# EAGLE schematic spi_tiny_usb (EAGLE 6.1)
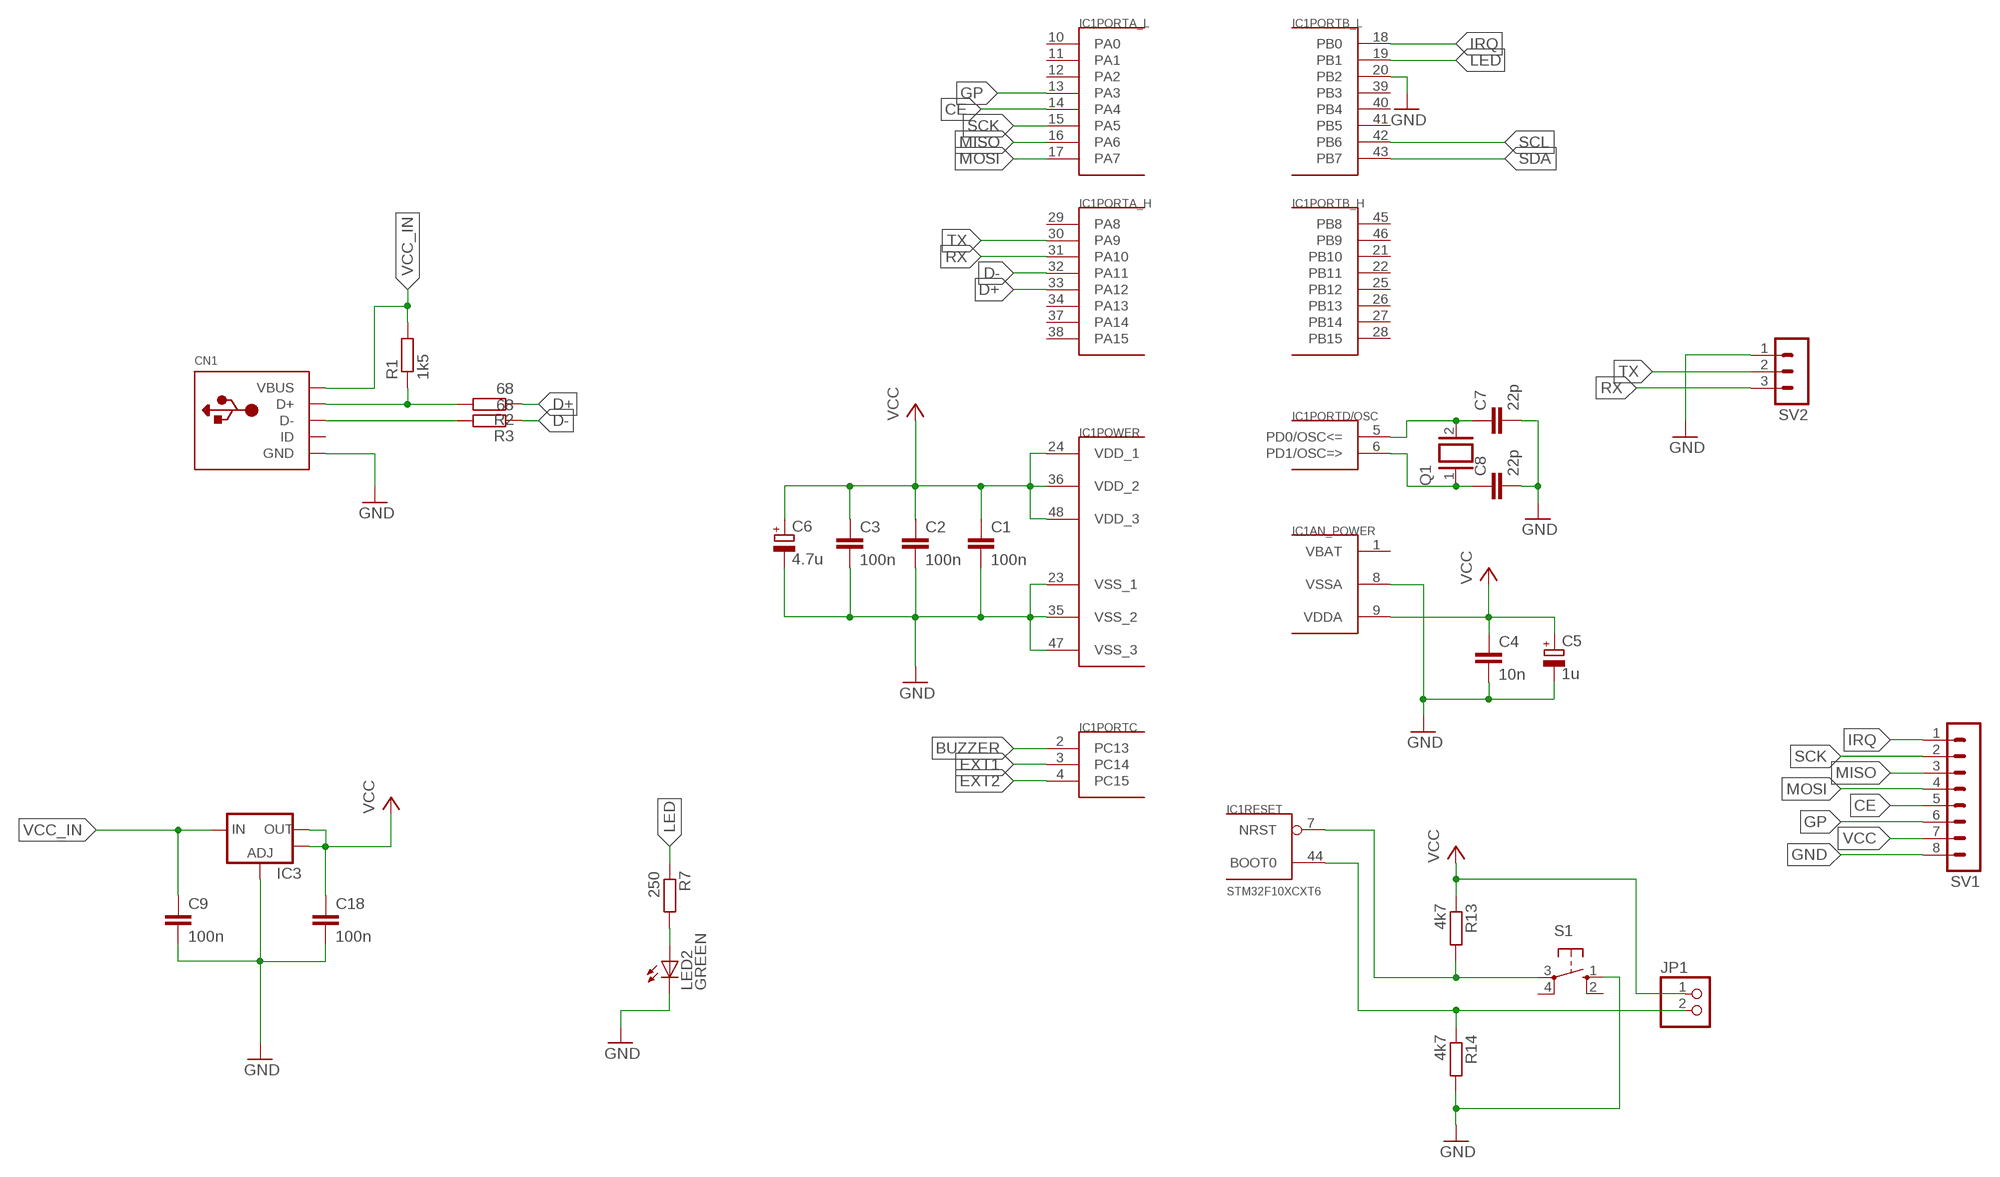
[diagram p0: schematic, sheet 1]

## Parts
C1  100n  C-EUC0805  [C0805]
C2  100n  C-EUC0805  [C0805]
C3  100n  C-EUC0805  [C0805]
C4  10n  C-EUC0805  [C0805]
C5  1u  CPOL-EU153CLV-0505  [153CLV-0505]
C6  4.7u  CPOL-EU153CLV-0505  [153CLV-0505]
C7  22p  C-EUC0805  [C0805]
C8  22p  C-EUC0805  [C0805]
C9  100n  C-EUC0805  [C0805]
C18  100n  C-EUC0805  [C0805]
CN1  USBMINIB  [USB-MINIB]
IC1  STM32F10XCXT6  [TQFP48]
IC3  V_REG_LM1117SOT223  [SOT223]
JP1  PINHD-1X2  [1X02]
LED2  GREEN  LEDCHIPLED_0805  [CHIPLED_0805]
Q1  XTAL/S  [QS]
R1  1k5  R-EU_M1206  [M1206]
R2  68  R-EU_M0805  [M0805]
R3  68  R-EU_M0805  [M0805]
R7  250  R-EU_R0805  [R0805]
R13  4k7  R-EU_R0805  [R0805]
R14  4k7  R-EU_R1206  [R1206]
S1  10-XX  [B3F-10XX]
SV1  MA08-1  [MA08-1]
SV2  MA03-1  [MA03-1]

## Nets
BUZZER: IC1.2(PORTC:PC13)
CE: IC1.14(PORTA_L:PA4) SV1.5
D+: IC1.33(PORTA_H:PA12) R2.1
D-: IC1.32(PORTA_H:PA11) R3.1
EXT1: IC1.3(PORTC:PC14)
EXT2: IC1.4(PORTC:PC15)
GND: C1.2 C2.2 C3.2 C4.2 C5.- C6.- C7.2 C8.2 C9.2 C18.2 CN1.GND IC1.8(AN_POWER:VSSA) IC1.20(PORTB_L:PB2) IC1.23(POWER:VSS_1) IC1.35(POWER:VSS_2) IC1.47(POWER:VSS_3) IC3.1(ADJ) LED2.C R14.2 S1.1(S) SV1.8 SV2.1
GP: IC1.13(PORTA_L:PA3) SV1.6
IRQ: IC1.18(PORTB_L:PB0) SV1.1
LED: IC1.19(PORTB_L:PB1) R7.1
MISO: IC1.16(PORTA_L:PA6) SV1.3
MOSI: IC1.17(PORTA_L:PA7) SV1.4
N$1: C7.1 IC1.5(PORTD/OSC:PD0/OSC<=) Q1.2
N$2: C8.1 IC1.6(PORTD/OSC:PD1/OSC=>) Q1.1
N$3: CN1.D+ R1.1 R2.2
N$4: CN1.D- R3.2
N$11: LED2.A R7.2
N$15: IC1.44(RESET:BOOT0) JP1.2 R14.1
RST: IC1.7(RESET:NRST) R13.2 S1.3(P)
RX: IC1.31(PORTA_H:PA10) SV2.3
SCK: IC1.15(PORTA_L:PA5) SV1.2
SCL: IC1.42(PORTB_L:PB6)
SDA: IC1.43(PORTB_L:PB7)
TX: IC1.30(PORTA_H:PA9) SV2.2
VCC: C1.1 C2.1 C3.1 C4.1 C5.+ C6.+ C18.1 IC1.9(AN_POWER:VDDA) IC1.24(POWER:VDD_1) IC1.36(POWER:VDD_2) IC1.48(POWER:VDD_3) IC3.2(OUT) IC3.4(OUT) JP1.1 R13.1 SV1.7
VCC_IN: C9.1 CN1.VBUS IC3.3(IN) R1.2
Unconnected: CN1.ID IC1.10(PORTA_L:PA0) IC1.11(PORTA_L:PA1) IC1.12(PORTA_L:PA2) IC1.21(PORTB_H:PB10) IC1.22(PORTB_H:PB11) IC1.25(PORTB_H:PB12) IC1.26(PORTB_H:PB13) IC1.27(PORTB_H:PB14) IC1.28(PORTB_H:PB15) IC1.29(PORTA_H:PA8) IC1.34(PORTA_H:PA13) IC1.37(PORTA_H:PA14) IC1.38(PORTA_H:PA15) IC1.39(PORTB_L:PB3) IC1.40(PORTB_L:PB4) IC1.41(PORTB_L:PB5) IC1.45(PORTB_H:PB8) IC1.46(PORTB_H:PB9) S1.2(S1) S1.4(P1)

## Power pins joined to a net without a drawn wire
VBAT: IC1.1(AN_POWER:VBAT)

## Library data of the parts
C1-C4 C7-C9 C18 = rcl-kd:C-EU: CAPACITOR, European symbol
C5 C6 = rcl-kd:CPOL-EU: POLARIZED CAPACITOR, European symbol
CN1 = adafruit:USB: USB Connectors USBMINIB - Surface Mount Female Mini-B USB Connector 4UConnector: 06564 By microbuilder.eu Thru-hole RA Female Mini-B USB Connector 4UConnector: 18732 By ladyada.net
IC1 = stm32:STM32F10XCXT6: ST STM32F101/103 48pin LQFP
IC3 = SparkFun:V_REG_LM1117: Voltage Regulator LM1117 Standard adjustable voltage regulator but in SMD form. Spark Fun Electronics SKU : COM-00595
JP1 = pinhead-kd:PINHD-1X2: PIN HEADER
LED2 = led:LED: LED OSRAM: - CHIPLED LG R971, LG N971, LY N971, LG Q971, LY Q971, LO R971, LY R971 LH N974, LH R974 LS Q976, LO Q976, LY Q976 LO Q996 - Hyper CHIPLED LW Q18S LB Q993, LB Q99A, LB R99A - SideLED LS A670, LO A670, LY A670, LG A670, LP A670 LB A673, LV A673, LT A673, LW A673 LH A674 LY A675 LS A676, LA A676, LO A676, LY A676, LW A676 LS A679, LY A679, LG A679 - Hyper Micro SIDELED® LS Y876, LA Y876, LO Y876, LY Y876 LT Y87S - SmartLED LW L88C, LW L88S LB L89C, LB L89S, LG L890 LS L89K, LO L89K, LY L89K LS L896, LA L896, LO L896, LY L896 - TOPLED LS T670, LO T670, LY T670, LG T670, LP T670 LSG T670, LSP T670, LSY T670, LOP T670, LYG T670 LG T671, LOG T671, LSG T671 LB T673, LV T673, LT T673, LW T673 LH T674 LS T676, LA T676, LO T676, LY T676, LB T676, LH T676, LSB T676, LW T676 LB T67C, LV T67C, LT T67C, LS T67K, LO T67K, LY T67K, LW E67C LS E67B, LA E67B, LO E67B, LY E67B, LB E67C, LV E67C, LT E67C LW T67C LS T679, LY T679, LG T679 LS T770, LO T770, LY T770, LG T770, LP T770 LB T773, LV T773, LT T773, LW T773 LH T774 LS E675, LA E675, LY E675, LS T675 LS T776, LA T776, LO T776, LY T776, LB T776 LHGB T686 LT T68C, LB T68C - Hyper Mini TOPLED® LB M676 - Mini TOPLED Santana® LG M470 LS M47K, LO M47K, LY M47K Source: http://www.osram.convergy.de LUXEON: - LUMILED® LXK2-PW12-R00, LXK2-PW12-S00, LXK2-PW14-U00, LXK2-PW14-V00 LXK2-PM12-R00, LXK2-PM12-S00, LXK2-PM14-U00 LXK2-PE12-Q00, LXK2-PE12-R00, LXK2-PE12-S00, LXK2-PE14-T00, LXK2-PE14-U00 LXK2-PB12-K00, LXK2-PB12-L00, LXK2-PB12-M00, LXK2-PB14-N00, LXK2-PB14-P00, LXK2-PB14-Q00 LXK2-PR12-L00, LXK2-PR12-M00, LXK2-PR14-Q00, LXK2-PR14-R00 LXK2-PD12-Q00, LXK2-PD12-R00, LXK2-PD12-S00 LXK2-PH12-R00, LXK2-PH12-S00 LXK2-PL12-P00, LXK2-PL12-Q00, LXK2-PL12-R00 Source: www.luxeon.com KINGBRIGHT: KA-3528ASYC Source: www.kingbright.com
Q1 = special:XTAL/S: CRYSTAL
R1-R3 R13 R14 = rcl-kd:R-EU_: RESISTOR, European symbol
R7 = resistor:R-EU_: RESISTOR, European symbol
S1 = switch-omron:10-XX: OMRON SWITCH; MPN: B3F-1000; OC_FARNELL: 176432; OC_NEWARK: 36M3542
SV1 = con-lstb:MA08-1: PIN HEADER; OC_FARNELL: unknown; OC_NEWARK: unknown
SV2 = con-lstb:MA03-1: PIN HEADER; OC_FARNELL: unknown; OC_NEWARK: unknown